# Altium schematic sheet TopLevel.SchDoc: =project_title
size Tabloid; CompanyName: Luxonis Holding; Organization: Luxonis Holding; Address1: 1925 Harmony Park Drive; Address2: Westminster, CO; Address3: 80234; Address4: United States; SheetNumber: 2; SheetTotal: 12
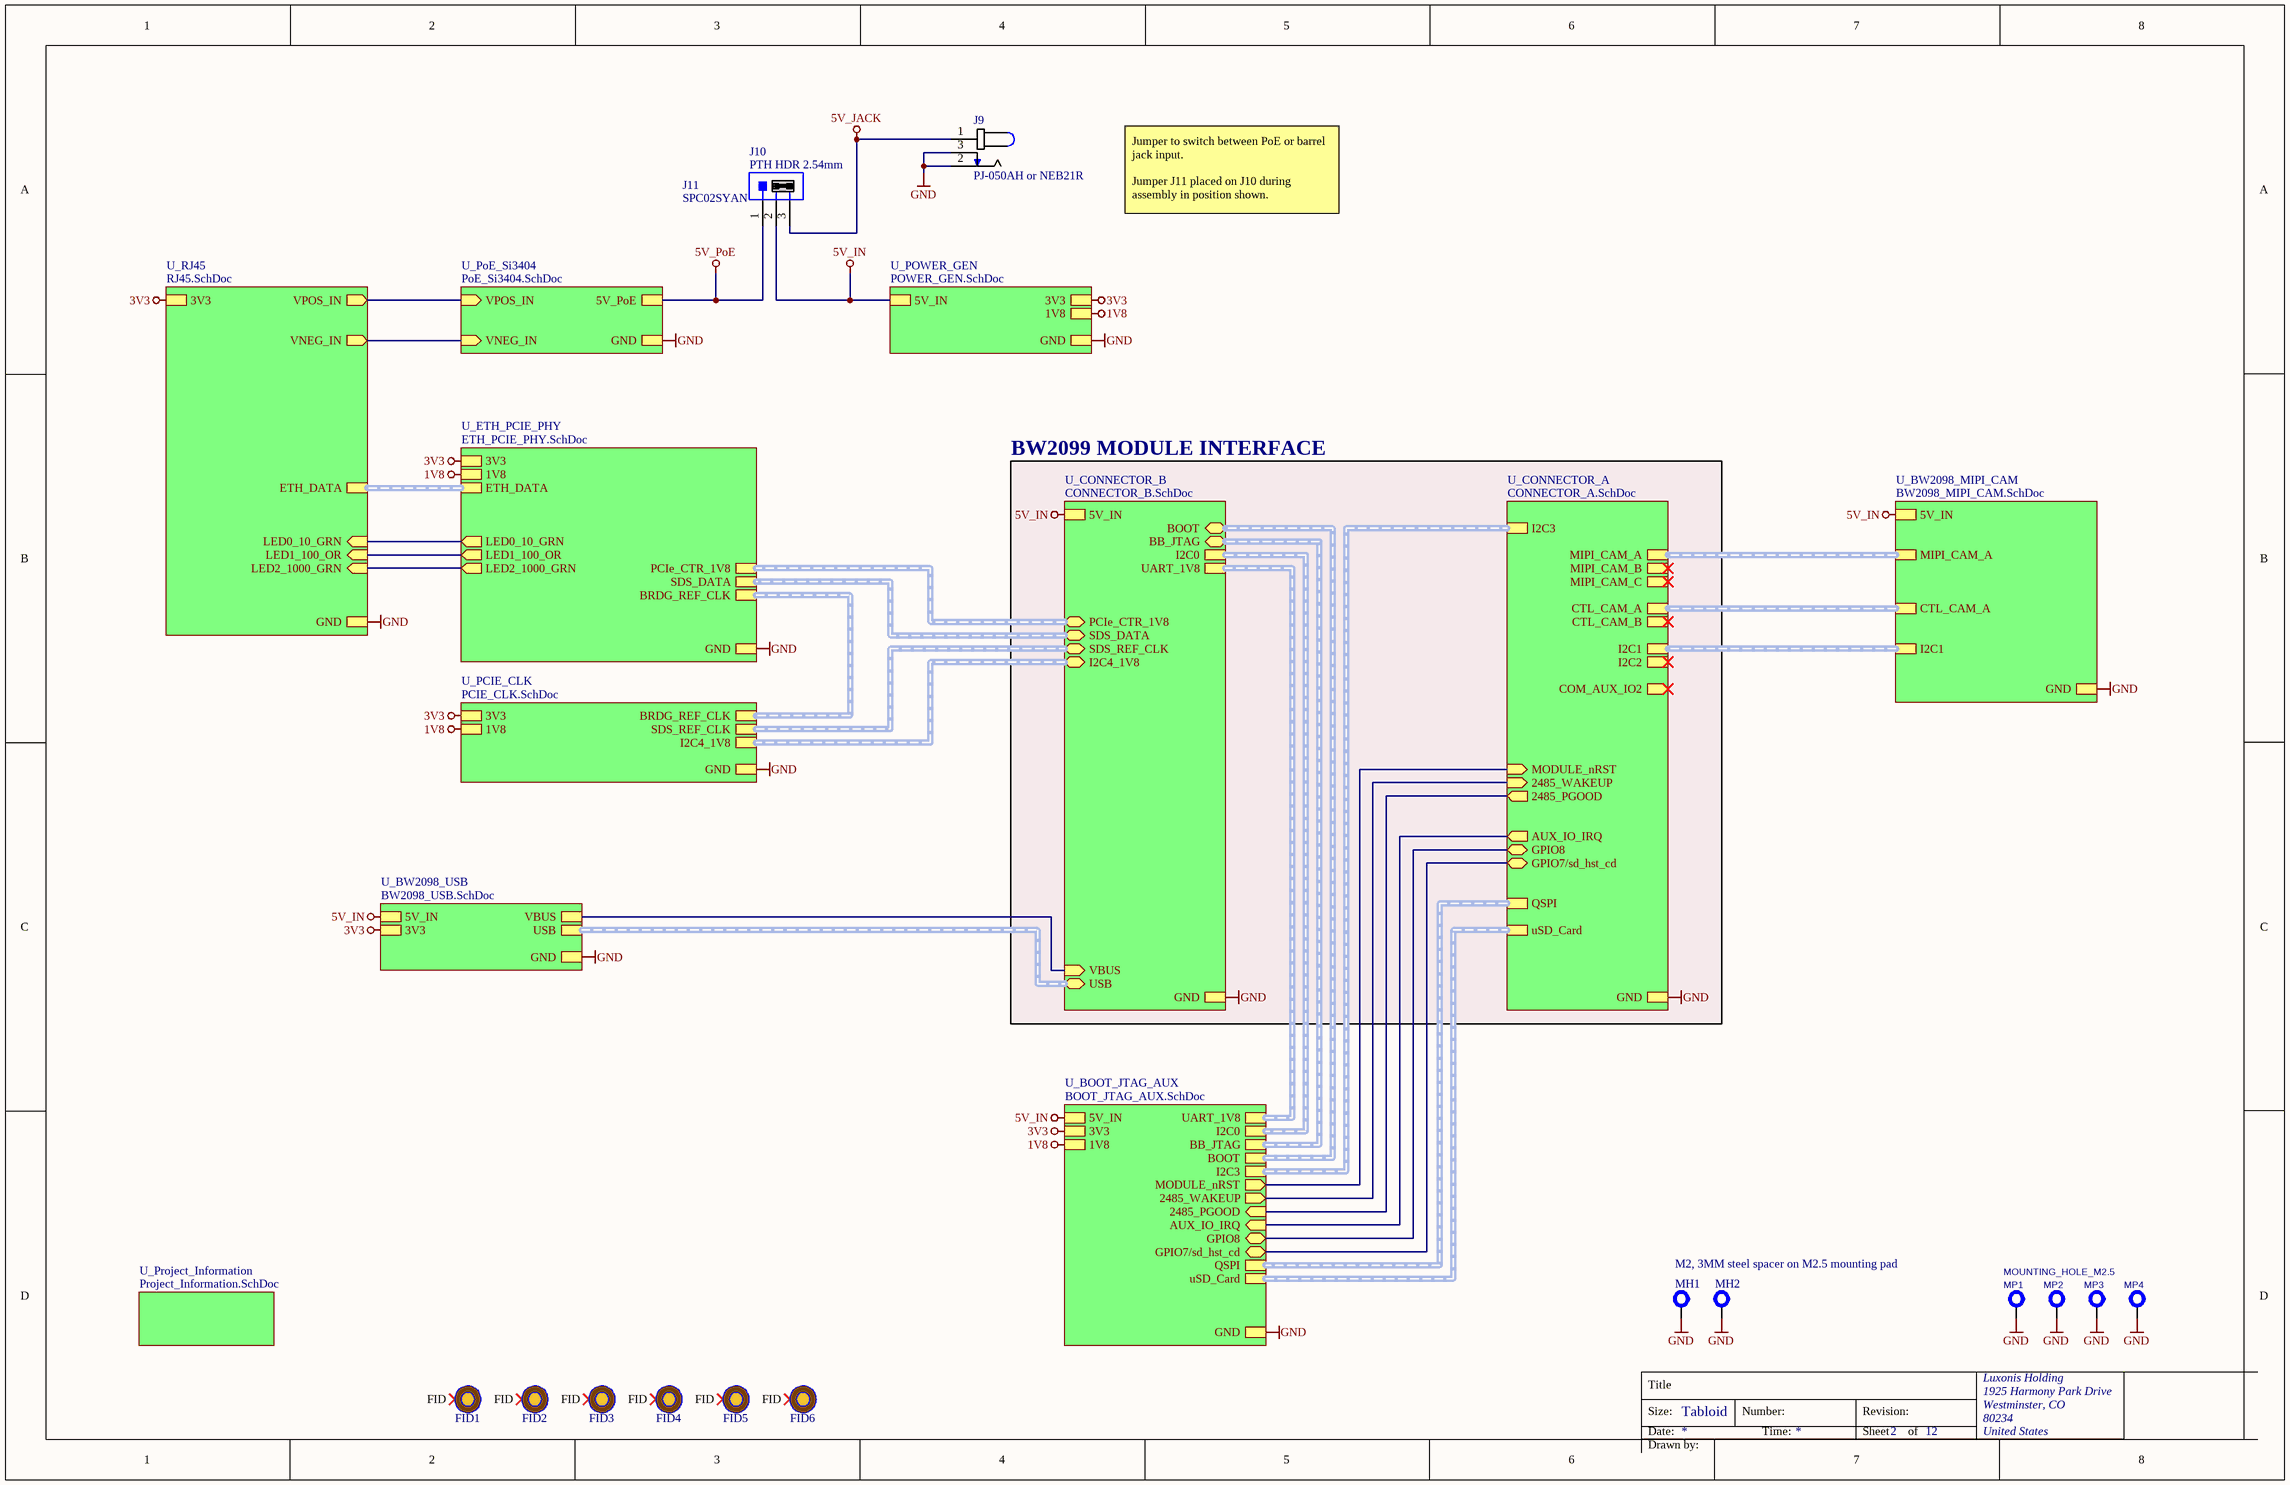
[diagram p0: TopLevel.SchDoc]

## Parts
FID1  FIDUCIAL_ROUND_1MM  [FIDUCIAL_ROUND_1MM]  (value not drawn)  (no BOM)
FID2  FIDUCIAL_ROUND_1MM  [FIDUCIAL_ROUND_1MM]  (value not drawn)  (no BOM)
FID3  FIDUCIAL_ROUND_1MM  [FIDUCIAL_ROUND_1MM]  (value not drawn)  (no BOM)
FID4  FIDUCIAL_ROUND_1MM  [FIDUCIAL_ROUND_1MM]  (value not drawn)  (no BOM)
FID5  FIDUCIAL_ROUND_1MM  [FIDUCIAL_ROUND_1MM]  (value not drawn)  (no BOM)
FID6  FIDUCIAL_ROUND_1MM  [FIDUCIAL_ROUND_1MM]  (value not drawn)  (no BOM)
J9  PJ-050AH or NEB21R  [PJ-050AH/NEB21R_COMBO]
J10  PTH HDR 2.54mm  [68000-103HLF]
J11  SPC02SYAN  [SPC02SYAN]
MH1  M2, 3MM steel spacer on M2.5 mounting pad  [9774030243R]
MH2  M2, 3MM steel spacer on M2.5 mounting pad  [9774030243R]  (value not drawn)
MP1  MOUNTING_HOLE_M2.5  [MOUNTING_HOLE_M2.5]  (no BOM)
MP2  MOUNTING_HOLE_M2.5  [MOUNTING_HOLE_M2.5]  (value not drawn)  (no BOM)
MP3  MOUNTING_HOLE_M2.5  [MOUNTING_HOLE_M2.5]  (value not drawn)  (no BOM)
MP4  MOUNTING_HOLE_M2.5  [MOUNTING_HOLE_M2.5]  (value not drawn)  (no BOM)

## Sub-sheets
U_BOOT_JTAG_AUX = BOOT_JTAG_AUX.SchDoc: GPIO8 (bidir), AUX_IO_IRQ (in), BOOT (harness BOOT), BB_JTAG (harness BB_JTAG), uSD_Card (harness uSD_Card), 2485_WAKEUP (out), QSPI (harness QSPI), I2C3 (harness I2C3), MODULE_nRST (out), UART_1V8 (harness UART_1V8), 2485_PGOOD (in), 1V8, 3V3, GND, 5V_IN, I2C0 (harness I2C0), GPIO7/sd_hst_cd (bidir)
U_BW2098_MIPI_CAM = BW2098_MIPI_CAM.SchDoc: I2C1 (harness I2C1), MIPI_CAM_A (harness MIPI_CAM_A), GND, 5V_IN, CTL_CAM_A (harness CTL_CAM_A)
U_BW2098_USB = BW2098_USB.SchDoc: USB (harness USB), GND, 5V_IN, 3V3, VBUS
U_CONNECTOR_A = CONNECTOR_A.SchDoc: AUX_IO_IRQ (out), I2C2 (harness I2C2), I2C1 (harness I2C1), QSPI (harness QSPI), uSD_Card (harness uSD_Card), MIPI_CAM_C (harness MIPI_CAM_C), CTL_CAM_A (harness CTL_CAM_A), MIPI_CAM_A (harness MIPI_CAM_A), MIPI_CAM_B (harness MIPI_CAM_B), GPIO8 (bidir), GND, I2C3 (harness I2C3), CTL_CAM_B (harness CTL_CAM_B), COM_AUX_IO2 (out), MODULE_nRST (in), 2485_WAKEUP (in), 2485_PGOOD (out), GPIO7/sd_hst_cd (bidir)
U_CONNECTOR_B = CONNECTOR_B.SchDoc: VBUS (in), UART_1V8 (harness UART_1V8), I2C0 (harness I2C0), 5V_IN, GND, BOOT (bidir, harness BOOT), PCIe_CTR_1V8 (bidir, harness PCIe_CTR_1V8), BB_JTAG (bidir, harness BB_JTAG), USB (bidir, harness USB), SDS_REF_CLK (bidir, harness SDS_REF_CLK), I2C4_1V8 (bidir, harness I2C4_1V8), SDS_DATA (bidir, harness Harness)
U_ETH_PCIE_PHY = ETH_PCIE_PHY.SchDoc: ETH_DATA (harness ETH_DATA), LED0_10_GRN (out), LED1_100_OR (out), LED2_1000_GRN (out), SDS_DATA (harness Harness), 3V3, GND, BRDG_REF_CLK (harness BRDG_REF_CLK), 1V8, PCIe_CTR_1V8 (harness PCIe_CTR_1V8)
U_PCIE_CLK = PCIE_CLK.SchDoc: BRDG_REF_CLK (harness BRDG_REF_CLK), SDS_REF_CLK (harness SDS_REF_CLK), GND, 3V3, 1V8, I2C4_1V8 (harness I2C4_1V8)
U_PoE_Si3404 = PoE_Si3404.SchDoc: 5V_PoE, GND, VPOS_IN (in), VNEG_IN (in)
U_POWER_GEN = POWER_GEN.SchDoc: GND, 3V3, 5V_IN, 1V8
U_Project_Information = Project_Information.SchDoc: no entries
U_RJ45 = RJ45.SchDoc: ETH_DATA (harness ETH_DATA), GND, LED0_10_GRN (in), 3V3, LED2_1000_GRN (in), LED1_100_OR (in), VPOS_IN (out), VNEG_IN (out)

## Nets
1V8: sheet U_ETH_PCIE_PHY/1V8, sheet U_PCIE_CLK/1V8, sheet U_BOOT_JTAG_AUX/1V8, sheet U_POWER_GEN/1V8
3V3: sheet U_ETH_PCIE_PHY/3V3, sheet U_RJ45/3V3, sheet U_PCIE_CLK/3V3, sheet U_BW2098_USB/3V3, sheet U_BOOT_JTAG_AUX/3V3, sheet U_POWER_GEN/3V3
5V_IN: J10.2 ; sheet U_CONNECTOR_B/5V_IN, sheet U_BW2098_MIPI_CAM/5V_IN, sheet U_BW2098_USB/5V_IN, sheet U_BOOT_JTAG_AUX/5V_IN, sheet U_POWER_GEN/5V_IN
5V_JACK: J9.1 J10.3
5V_PoE: J10.1 ; sheet U_PoE_Si3404/5V_PoE
GND: J9.2 J9.3 MH1.1 MH2.1 MP1.1 MP2.1 MP3.1 MP4.1 ; sheet U_CONNECTOR_B/GND, sheet U_CONNECTOR_A/GND, sheet U_ETH_PCIE_PHY/GND, sheet U_RJ45/GND, sheet U_PCIE_CLK/GND, sheet U_BW2098_MIPI_CAM/GND, sheet U_BW2098_USB/GND, sheet U_BOOT_JTAG_AUX/GND, sheet U_PoE_Si3404/GND, sheet U_POWER_GEN/GND
(unnamed): sheet U_CONNECTOR_B/VBUS, sheet U_BW2098_USB/VBUS
(unnamed): sheet U_CONNECTOR_A/AUX_IO_IRQ, sheet U_BOOT_JTAG_AUX/AUX_IO_IRQ
(unnamed): sheet U_CONNECTOR_A/GPIO8, sheet U_BOOT_JTAG_AUX/GPIO8
(unnamed): sheet U_CONNECTOR_A/MODULE_nRST, sheet U_BOOT_JTAG_AUX/MODULE_nRST
(unnamed): sheet U_CONNECTOR_A/2485_WAKEUP, sheet U_BOOT_JTAG_AUX/2485_WAKEUP
(unnamed): sheet U_CONNECTOR_A/2485_PGOOD, sheet U_BOOT_JTAG_AUX/2485_PGOOD
(unnamed): sheet U_CONNECTOR_A/GPIO7/sd_hst_cd, sheet U_BOOT_JTAG_AUX/GPIO7/sd_hst_cd
(unnamed): sheet U_ETH_PCIE_PHY/LED0_10_GRN, sheet U_RJ45/LED0_10_GRN
(unnamed): sheet U_ETH_PCIE_PHY/LED1_100_OR, sheet U_RJ45/LED1_100_OR
(unnamed): sheet U_ETH_PCIE_PHY/LED2_1000_GRN, sheet U_RJ45/LED2_1000_GRN
(unnamed): sheet U_RJ45/VPOS_IN, sheet U_PoE_Si3404/VPOS_IN
(unnamed): sheet U_RJ45/VNEG_IN, sheet U_PoE_Si3404/VNEG_IN

Not connected (* = marked no-connect by the designer): FID1 FID*; FID2 FID*; FID3 FID*; FID4 FID*; FID5 FID*; FID6 FID*

## Buses and harness runs
harness sheet U_BOOT_JTAG_AUX/BB_JTAG = sheet U_CONNECTOR_B/BB_JTAG
harness sheet U_BOOT_JTAG_AUX/BOOT = sheet U_CONNECTOR_B/BOOT
harness sheet U_BOOT_JTAG_AUX/I2C0 = sheet U_CONNECTOR_B/I2C0
harness sheet U_BOOT_JTAG_AUX/I2C3 = sheet U_CONNECTOR_A/I2C3
harness sheet U_BOOT_JTAG_AUX/QSPI = sheet U_CONNECTOR_A/QSPI
harness sheet U_BOOT_JTAG_AUX/UART_1V8 = sheet U_CONNECTOR_B/UART_1V8
harness sheet U_BOOT_JTAG_AUX/uSD_Card = sheet U_CONNECTOR_A/uSD_Card
harness sheet U_BW2098_MIPI_CAM/CTL_CAM_A = sheet U_CONNECTOR_A/CTL_CAM_A
harness sheet U_BW2098_MIPI_CAM/I2C1 = sheet U_CONNECTOR_A/I2C1
harness sheet U_BW2098_MIPI_CAM/MIPI_CAM_A = sheet U_CONNECTOR_A/MIPI_CAM_A
harness sheet U_BW2098_USB/USB = sheet U_CONNECTOR_B/USB
harness sheet U_CONNECTOR_B/I2C4_1V8 = sheet U_PCIE_CLK/I2C4_1V8
harness sheet U_CONNECTOR_B/PCIe_CTR_1V8 = sheet U_ETH_PCIE_PHY/PCIe_CTR_1V8
harness sheet U_CONNECTOR_B/SDS_DATA = sheet U_ETH_PCIE_PHY/SDS_DATA
harness sheet U_CONNECTOR_B/SDS_REF_CLK = sheet U_PCIE_CLK/SDS_REF_CLK
harness sheet U_ETH_PCIE_PHY/BRDG_REF_CLK = sheet U_PCIE_CLK/BRDG_REF_CLK
harness sheet U_ETH_PCIE_PHY/ETH_DATA = sheet U_RJ45/ETH_DATA

## Notes on the sheet
- Jumper to switch between PoE or barrel jack input.
  Jumper J11 placed on J10 during assembly in position shown.
- BW2099 MODULE INTERFACE
- Title
- Size:
- Date:
- Tabloid
- Number:
- Time:
- Revision:
- Sheet
- of
- Drawn by:

## Library data of the parts
FID1-FID6 = FIDUCIAL: Fiducial with various available footprints
J9 = PJ-050AH/NEB21R_COMBO: CONN POWER PIN 2 POS RA PTH Barrel jack 2.1mm x 5.5mm combo footprint; Manufacturer 1: CUI; Gender: Male; Shielding: Unshielded; Current Rating: 5A; Voltage Rating: 24V; Insulation Resistance: 100MR; Number of Conductors: 2; Max Current Rating: 3A; Voltage Rating (DC): 12V; Number of Ports: 1; Inside Diameter: 6mm; Supplier 1: Mouser; Manufacturer Part Number 1: PJ-050AH; Stock 1: 2665; Pricing 1: 1=0.78000, 10=0.68800, 50=0.62100, 100=0.59400, 1000=0.43200, 10000=0.39100 (USD); Mount: Through Hole; Color: Black; Contact Material: Copper; Contact Plating: Nickel; Housing Color: Black; Housing Material: Thermoplastic; Min Operating Temperature: -25°C; Max Operating Temperature: 85°C; Package Quantity: 500; Termination: Solder; Connector Type: Jack; Contact Gender: Male; Orientation: Horizontal; Lead Free: Lead Free; Flammability Rating: UL94 V-0; ComponentLink1URL: http://www.mouser.com/ds/2/670/PJ-050AH-524150.pdf?src-supplier=Mouser; ComponentLink1Description: http://www.mouser.com/ds/2/670/PJ-050AH-524150.pdf?src-supplier=Mouser; ComponentLink2URL: https://www.cui.com/product/resource/digikeypdf/pj-050ah.pdf?src-supplier=Digi-Key; ComponentLink2Description: https://www.cui.com/product/resource/digikeypdf/pj-050ah.pdf?src-supplier=Digi-Key; ComponentLink3URL: http://datasheet.octopart.com/PJ-050AH-CUI-datasheet-15696426.pdf?src-supplier=CUI; ComponentLink3Description: http://datasheet.octopart.com/PJ-050AH-CUI-datasheet-15696426.pdf?src-supplier=CUI; ComponentLink4URL: http://datasheet.octopart.com/PJ-050AH-CUI-datasheet-62089837.pdf?src-supplier=CUI; ComponentLink4Description: http://datasheet.octopart.com/PJ-050AH-CUI-datasheet-62089837.pdf?src-supplier=CUI; ComponentLink5URL: http://datasheet.octopart.com/PJ-050AH-CUI-datasheet-65972796.pdf?src-supplier=CUI; ComponentLink5Description: http://datasheet.octopart.com/PJ-050AH-CUI-datasheet-65972796.pdf?src-supplier=CUI; ComponentLink6URL: http://datasheet.octopart.com/PJ-050AH-CUI-datasheet-103766550.pdf?src-supplier=CUI; ComponentLink6Description: http://datasheet.octopart.com/PJ-050AH-CUI-datasheet-103766550.pdf?src-supplier=CUI; ComponentLink7URL: http://datasheet.octopart.com/PJ-050AH-CUI-datasheet-103111417.pdf?src-supplier=Electro+Sonic; ComponentLink7Description: http://datasheet.octopart.com/PJ-050AH-CUI-datasheet-103111417.pdf?src-supplier=Electro+Sonic; ComponentLink8URL: http://datasheet.octopart.com/PJ-050AH-CUI-datasheet-34390405.pdf?src-supplier=Future+Electronics; ComponentLink8Description: http://datasheet.octopart.com/PJ-050AH-CUI-datasheet-34390405.pdf?src-supplier=Future+Electronics; ComponentLink9URL: http://datasheet.octopart.com/PJ-050AH-CUI-datasheet-62073522.pdf?src-supplier=Future+Electronics; ComponentLink9Description: http://datasheet.octopart.com/PJ-050AH-CUI-datasheet-62073522.pdf?src-supplier=Future+Electronics; ComponentLink10URL: http://datasheet.octopart.com/PJ-050AH-CUI-datasheet-102985732.pdf?src-supplier=Future+Electronics; ComponentLink10Description: http://datasheet.octopart.com/PJ-050AH-CUI-datasheet-102985732.pdf?src-supplier=Future+Electronics; Supplier 2: Newark; Manufacturer 2: Lumberg; Manufacturer Part Number 2: NEB 21 R; Stock 2: 56; Pricing 2: 1=0.86400, 25=0.82100, 50=0.78300, 100=0.72900, 250=0.68600 (USD); Number of Pins: 2; Number of Terminals: 3; Packaging: Bulk; Max Voltage Rating (DC): 12V; Voltage Rating (AC): 12V; Length: 9mm; Depth: 14.5mm; REACH SVHC: No SVHC; ComponentLink11URL: https://datasheet.ciiva.com/11720/0900766b805694d6-11720273.pdf?src-supplier=RSComponents; ComponentLink11Description: https://datasheet.ciiva.com/11720/0900766b805694d6-11720273.pdf?src-supplier=RSComponents; ComponentLink12URL: https://datasheet.ciiva.com/1115/28897-1115898.pdf?src-supplier=Newark; ComponentLink12Description: https://datasheet.ciiva.com/1115/28897-1115898.pdf?src-supplier=Newark; ComponentLink13URL: https://datasheet.ciiva.com/8066/1700582-8066298.pdf?src-supplier=Element14; ComponentLink13Description: https://datasheet.ciiva.com/8066/1700582-8066298.pdf?src-supplier=Element14; ComponentLink14URL: https://datasheet.ciiva.com/29365/738882-da-01-ml-netzger-einbaukuppl-neb-21-r-de-en-fr-29365351.pdf?src-supplier=Conrad; ComponentLink14Description: https://datasheet.ciiva.com/29365/738882-da-01-ml-netzger-einbaukuppl-neb-21-r-de-en-fr-29365351.pdf?src-supplier=Conrad; ComponentLink15URL: http://datasheet.octopart.com/NEB-21-R-Lumberg-datasheet-15206778.pdf?src-supplier=Newark; ComponentLink15Description: http://datasheet.octopart.com/NEB-21-R-Lumberg-datasheet-15206778.pdf?src-supplier=Newark; ComponentLink16URL: http://datasheet.octopart.com/NEB-21-R-Lumberg-datasheet-103789672.pdf?src-supplier=Farnell; ComponentLink16Description: http://datasheet.octopart.com/NEB-21-R-Lumberg-datasheet-103789672.pdf?src-supplier=Farnell; ComponentLink17URL: http://datasheet.octopart.com/NEB-21-R-Lumberg-datasheet-136395310.pdf?src-supplier=Toby+Electronics; ComponentLink17Description: http://datasheet.octopart.com/NEB-21-R-Lumberg-datasheet-136395310.pdf?src-supplier=Toby+Electronics; Supplier Part Number 1: 490-PJ-050AH; Supplier Part Number 2: 97K6458; Supplier 3: Digi-Key; Supplier Part Number 3: CP-050AH-ND; Supplier 4: Element14; Supplier Part Number 4: 1217037
J10 = 68000-103HLF: Conn Unshrouded Header HDR 3 POS 2.54mm Solder ST Thru-Hole Bulk; Manufacturer 1: Amphenol FCI; Number of Positions: 3; Connector Type: Male Pin; Current Rating: 3A; Voltage Rating: 1.5kV; Insulation Resistance: 5GR; Gender: Male; Contact Post Length: 2.41mm; Supplier 1: Digi-Key; Manufacturer Part Number 1: 68000-103HLF; RoHS: Yes; Category: Headers and Wire Housings; Stock 1: 28978; Pricing 1: 1=0.29000, 10=0.27900, 100=0.19500, 500=0.16716, 1000=0.13930, 5000=0.11940, 10000=0.11144 (USD); Mount: Through Hole; Contact Plating: Gold,GXT; Contact Material: Bronze; Color: Black; Housing Color: Black; Housing Material: Thermoplastic; Min Operating Temperature: -65°C; Max Operating Temperature: 125°C; Number of Rows: 1; Termination: Through Hole; Packaging: Bulk; Number of Contacts: 3; Contact Gender: Male; Package Quantity: 100; Max Voltage Rating (AC): 1.5kV; Orientation: Straight; Length: 7.62mm; Pitch: 2.54mm; Contact Mating Length: 5.84mm; Depth: 2.41mm; Radiation Hardening: No; Flammability Rating: UL94 V-0; REACH SVHC: No SVHC; ComponentLink1URL: https://datasheet.ciiva.com/5157/68000-274283-5157301.pdf?src-supplier=Mouser; ComponentLink1Description: https://datasheet.ciiva.com/5157/68000-274283-5157301.pdf?src-supplier=Mouser; ComponentLink2URL: https://datasheet.ciiva.com/46392/1914865-46392021.pdf?src-supplier=Element14; ComponentLink2Description: https://datasheet.ciiva.com/46392/1914865-46392021.pdf?src-supplier=Element14; ComponentLink3URL: https://datasheet.ciiva.com/10149/68000-10149754.pdf?src-supplier=Avnet; ComponentLink3Description: https://datasheet.ciiva.com/10149/68000-10149754.pdf?src-supplier=Avnet; Supplier 2: Avnet; Supplier 3: Mouser; Supplier Part Number 1: 609-3461-ND; Supplier Part Number 2: 68000-103HLF; Supplier Part Number 3: 649-68000-103HLF
J11 = SPC02SYAN: CONN JUMPER SHORTING GOLD FLASH; Manufacturer 1: Sullins; Number of Positions: 2; Pitch: 0.1inch; Supplier 1: Digi-Key; Manufacturer Part Number 1: SPC02SYAN; RoHS: Yes; Category: Connectors; Stock 1: 308371; Pricing 1: 1=0.10000, 10=0.05900, 25=0.04400, 50=0.03780, 100=0.03650, 250=0.03152, 500=0.03024, 1000=0.02646, 2500=0.02394 (USD); Color: Black; Contact Plating: Gold; Package Quantity: 1000; Packaging: Bulk; Height: 0.256inch; Lead Free: Lead Free; ComponentLink1URL: https://datasheet.ciiva.com/16203/spc02syan-0-3293-16203044.pdf?src-supplier=Future+Electronics; ComponentLink1Description: https://datasheet.ciiva.com/16203/spc02syan-0-3293-16203044.pdf?src-supplier=Future+Electronics; ComponentLink2URL: https://datasheet.ciiva.com/767/134-c02syan-11134-767878.pdf?src-supplier=Digi-Key; ComponentLink2Description: https://datasheet.ciiva.com/767/134-c02syan-11134-767878.pdf?src-supplier=Digi-Key; Supplier Part Number 1: S9001-ND; Supplier 2: Future Electronics; Supplier Part Number 2: SPC02SYAN-BAG
MH1 MH2 = 9774030243R: MP ROUND STANDOFF M2X0.4 STEEL 3MM; Manufacturer 1: Wurth Electronics; Plating: Tin; Threaded/Unthreaded: Threaded; Outside Diameter: 0.171inch; Supplier 1: Digi-Key; Manufacturer Part Number 1: 9774030243R; Stock 1: 20568; Pricing 1: 1=0.95000, 10=0.91800, 50=0.79500, 100=0.73900 (USD); RoHS: Yes; Material: Steel; Length: 0.173inch; REACH SVHC: Unknown; ComponentLink1URL: http://www.mouser.com/ds/2/445/9774030243R-611455.pdf?src-supplier=Mouser; ComponentLink1Description: http://www.mouser.com/ds/2/445/9774030243R-611455.pdf?src-supplier=Mouser; ComponentLink2URL: http://www.farnell.com/datasheets/1960368.pdf?src-supplier=Farnell; ComponentLink2Description: http://www.farnell.com/datasheets/1960368.pdf?src-supplier=Farnell; ComponentLink3URL: https://katalog.we-online.de/em/datasheet/9774030243R.pdf?src-supplier=Digi-Key; ComponentLink3Description: https://katalog.we-online.de/em/datasheet/9774030243R.pdf?src-supplier=Digi-Key; ComponentLink4URL: http://www.farnell.com/datasheets/1960368.pdf?src-supplier=Newark; ComponentLink4Description: http://www.farnell.com/datasheets/1960368.pdf?src-supplier=Newark; ComponentLink5URL: http://www.farnell.com/datasheets/1960368.pdf?src-supplier=Element14; ComponentLink5Description: http://www.farnell.com/datasheets/1960368.pdf?src-supplier=Element14; Supplier Part Number 1: 732-7085-1-ND; Supplier 2: Mouser; Supplier Part Number 2: 710-9774030243R; Supplier 3: Element14; Supplier Part Number 3: 2497599
MP1-MP4 = MP_Mounting-Holes: =CurrentFootprint; B - Value: Not a Part; A - Level: 0